# EasyEDA Pro project demo1.eprj

# Schematic Schematic1
Create Date: 2024-06-09; Page Name: P1; Project Name: demo1; Schematic Name: Schematic1; Update Date: 2024-07-16; Company: 嘉立创EDA; Page Size: A4; Version: V1.0
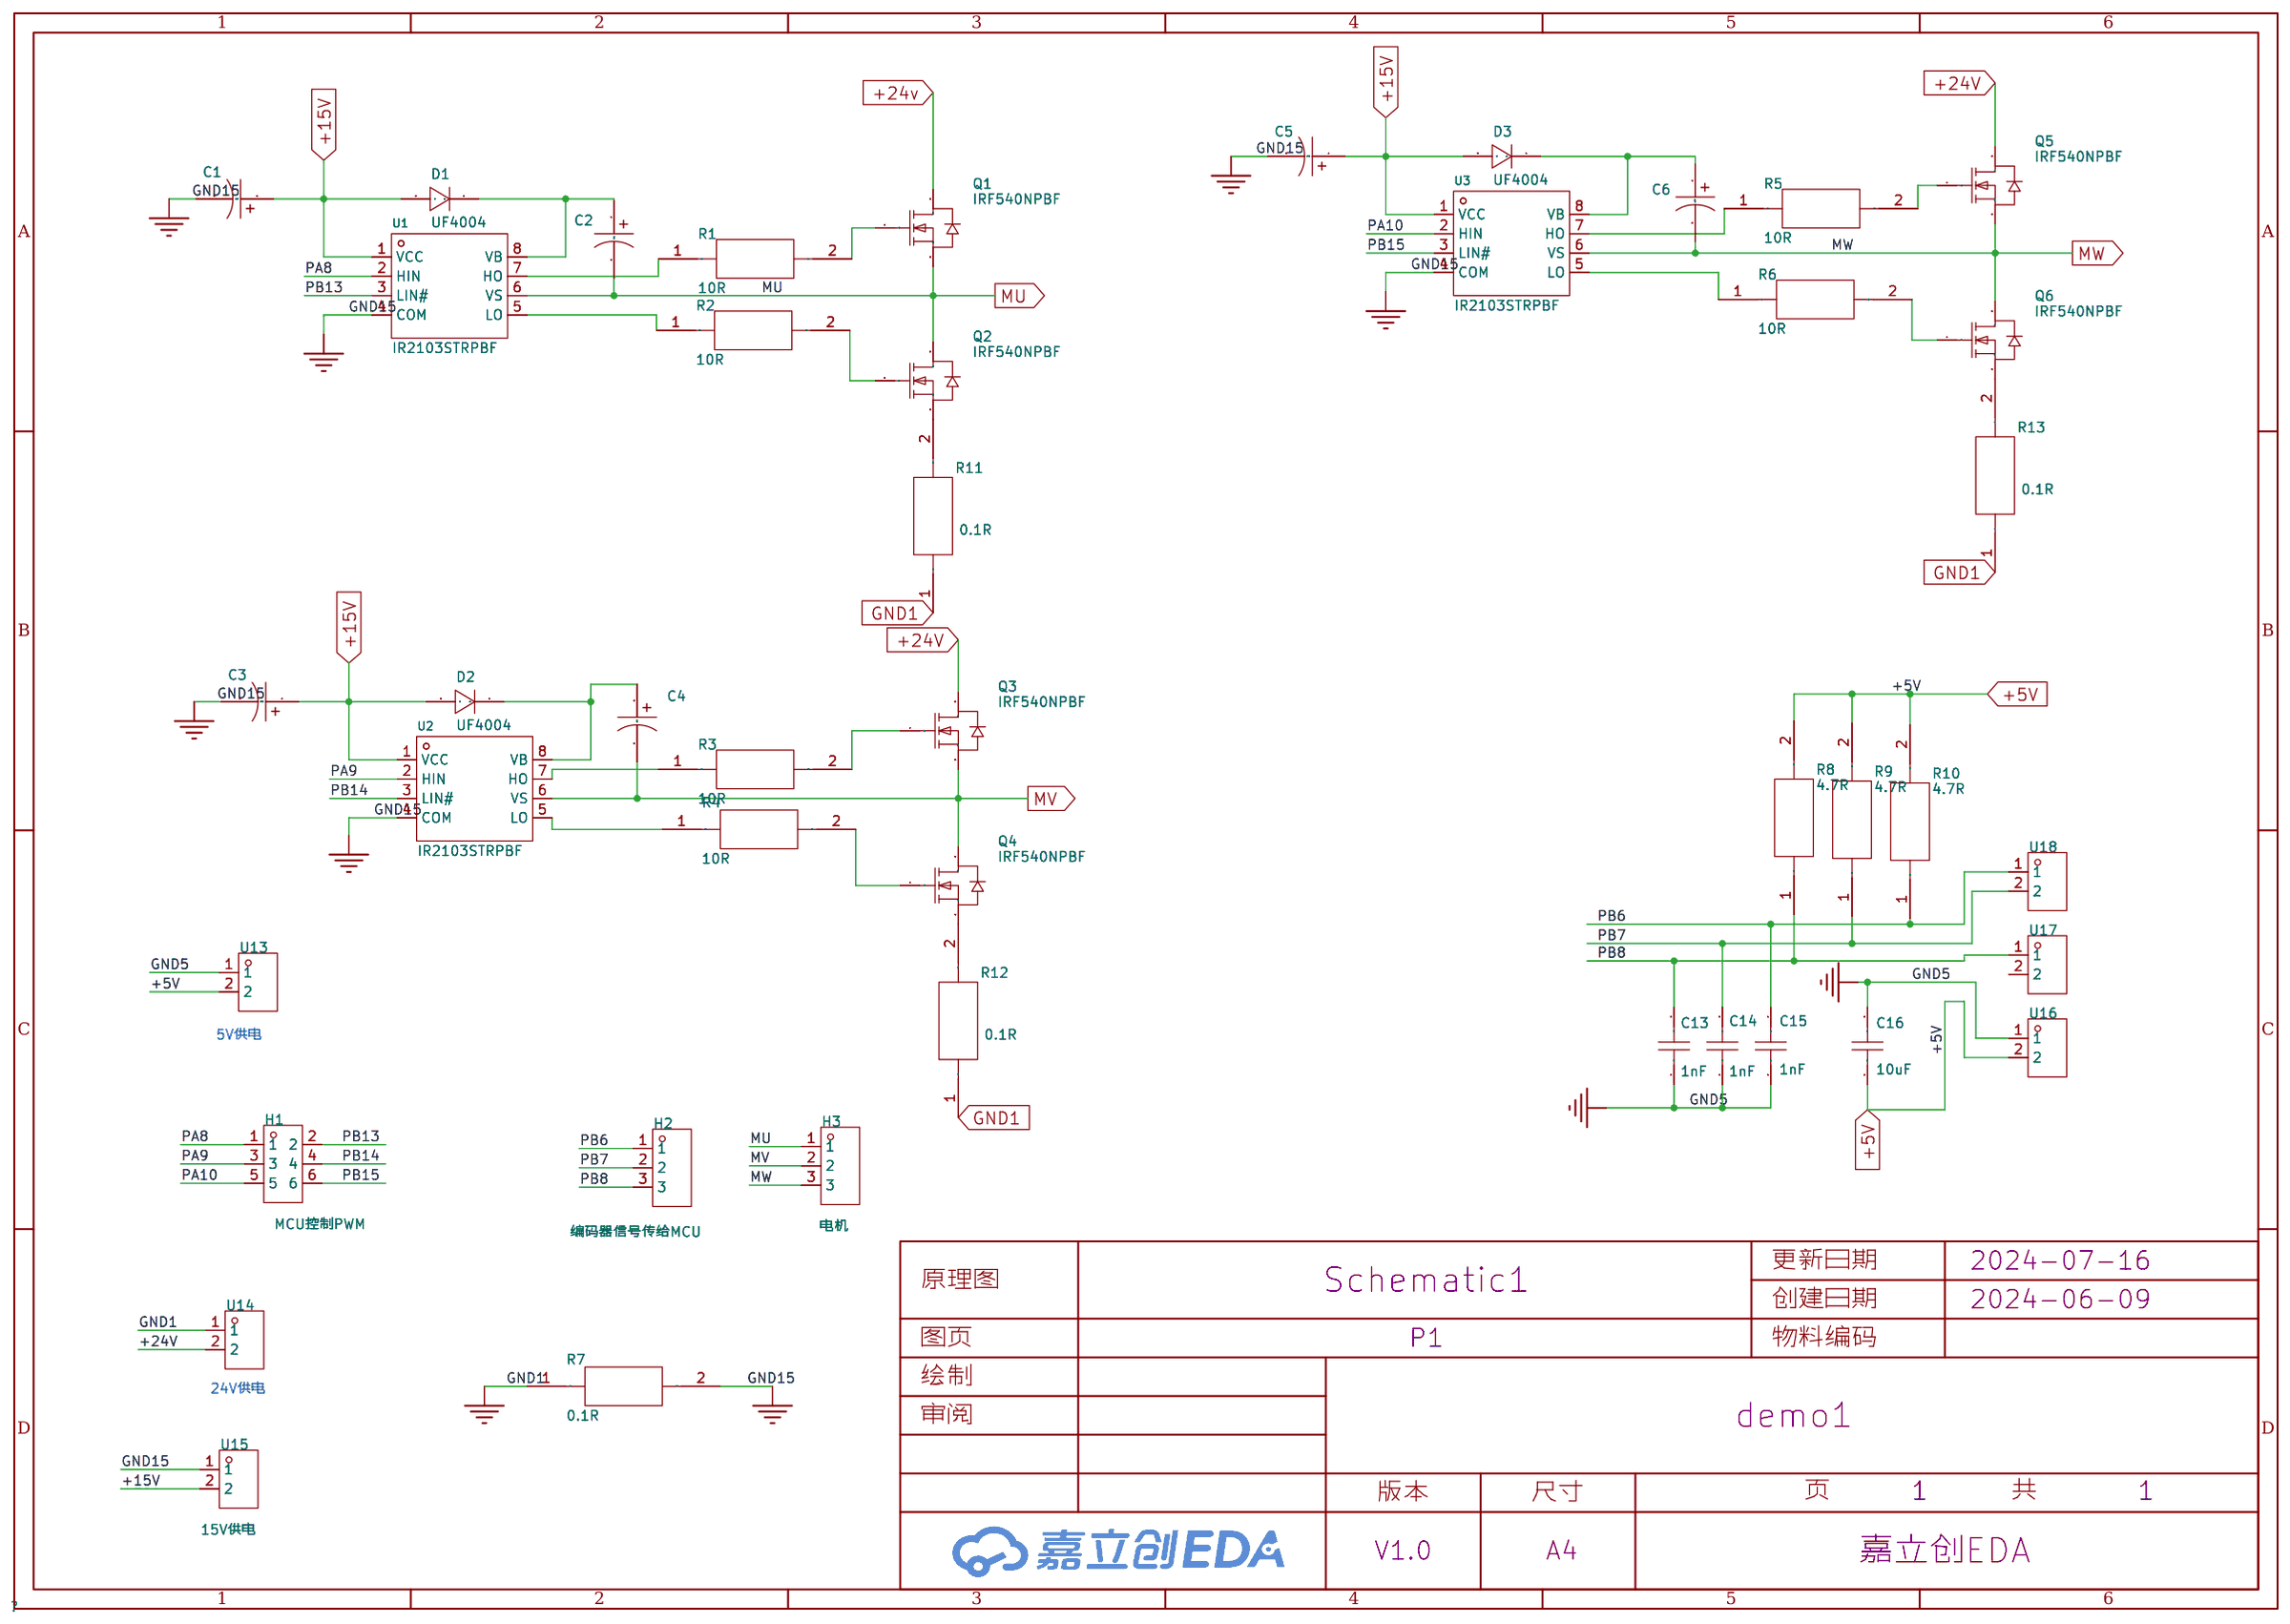
[diagram p0: schematic sheet]

## Parts
C1  -  [钽电容]
C2  -  [钽电容]
C3  -  [钽电容]
C4  -  [钽电容]
C5  -  [钽电容]
C6  -  [钽电容]
C13  1nF  [独石电容]
C14  1nF  [独石电容]
C15  1nF  [独石电容]
C16  10uF  [独石电容]
D1  UF4004  [DO-41_BD2.4-L4.7-P8.70-D0.9-RD]
D2  UF4004  [DO-41_BD2.4-L4.7-P8.70-D0.9-RD]
D3  UF4004  [DO-41_BD2.4-L4.7-P8.70-D0.9-RD]
H1  MCU控制PWM  [HDR-TH_6P-P2.54-V-M-R2-C3-S2.54]
H2  编码器信号传给MCU  [HDR-TH_3P-P2.54-V-M]
H3  电机  [HDR-TH_3P-P2.54-V-M]
Q1  IRF540NPBF  [TO-220-3_L10.0-W4.5-P2.54-L]
Q2  IRF540NPBF  [TO-220-3_L10.0-W4.5-P2.54-L]
Q3  IRF540NPBF  [TO-220-3_L10.0-W4.5-P2.54-L]
Q4  IRF540NPBF  [TO-220-3_L10.0-W4.5-P2.54-L]
Q5  IRF540NPBF  [TO-220-3_L10.0-W4.5-P2.54-L]
Q6  IRF540NPBF  [TO-220-3_L10.0-W4.5-P2.54-L]
R1  10R  [大电阻]
R2  10R  [大电阻]
R3  10R  [大电阻]
R4  10R  [大电阻]
R5  10R  [大电阻]
R6  10R  [大电阻]
R7  0.1R  [大电阻]
R8  4.7R  [大电阻]
R9  4.7R  [大电阻]
R10  4.7R  [大电阻]
R11  0.1R  [大电阻]
R12  0.1R  [大电阻]
R13  0.1R  [大电阻]
U1  IR2103STRPBF  [IR2103STRPBF]
U2  IR2103STRPBF  [IR2103STRPBF]
U3  IR2103STRPBF  [IR2103STRPBF]
U13  DB125-3.81-2P-GN-S  [CONN-TH_2P-P3.81_L7.4-W7.6]
U14  DB125-3.81-2P-GN-S  [CONN-TH_2P-P3.81_L7.4-W7.6]
U15  15V供电  [CONN-TH_2P-P3.81_L7.4-W7.6]
U16  DB125-3.81-2P-GN-S  [CONN-TH_2P-P3.81_L7.4-W7.6]
U17  DB125-3.81-2P-GN-S  [CONN-TH_2P-P3.81_L7.4-W7.6]
U18  DB125-3.81-2P-GN-S  [CONN-TH_2P-P3.81_L7.4-W7.6]

## Library data of the parts
C1-C6 = 钽电容
C13-C16 = 独石电容
D1-D3 = UF4004: 二极管配置:-;正向压降(Vf):1V@1A;直流反向耐压(Vr):400V;平均整流电流(Io):1A;; LCSC Part Name: 电压:400V 电流:1A; Supplier Part: C402308; Manufacturer: LGE(鲁光); Supplier Footprint: DO-41; JLCPCB Part Class: 扩展库; Datasheet: https://atta.szlcsc.com/upload/public/pdf/source/20190705/C402309_612B1FC0F422580FB6CB8C47AC7B40D2.pdf; Supplier: LCSC; Forward Voltage (Vf@If): 1V@1A; Reverse Voltage (Vr): 400V; Average Rectified Current (Io): 1A; Reverse Leakage Current: 10uA@400V
H1 = PZ254V-12-6P: 插针结构:2x3P;间距:2.54mm;行距:2.54mm;圆针/方针:方针;安装类型:直插;排数:双排;总PIN位数:6P;额定电流:-;额定电压:-;配合针长度:6mm;塑高:2.5mm;端接针长度:3mm;触头材质:黄铜;触头镀层:-;工作温度范围:-40℃~+105℃;颜色:黑色;; LCSC Part Name: 间距:2.54mm 2x3P 直插 方针; Supplier Part: C492420; Manufacturer: XFCN(兴飞); Supplier Footprint: 插件,P=2.54mm; JLCPCB Part Class: 扩展库; Datasheet: https://atta.szlcsc.com/upload/public/pdf/source/20200309/C492420_BAECB307B001054C09D200388220EAE6.pdf; Supplier: LCSC; Pin Structure: 2x3P; Pitch: 2.54mm; Row Spacing: 2.54mm; Circluar Pins/Square Pins: 方针; Mounting Type: 直插; Number of Rows: 双排; Number of Pins: 6P; Length of Mating Pin: 6mm; Insulation Height: 2.5mm; Length of End Connection Pin: 3mm; Contact Material: 黄铜; Operating Temperature Range: -40℃~+105℃; Color: 黑色
H2 H3 = PZ254V-11-03P: 插针结构:1x3P;间距:2.54mm;行距:-;圆针/方针:方针;安装类型:直插;排数:单排;总PIN位数:3P;额定电流:3A;额定电压:250V;配合针长度:6mm;塑高:2.5mm;端接针长度:3mm;工作温度范围:-40℃~+105℃;颜色:黑色;; LCSC Part Name: 间距:2.54mm 1x3P 直插 方针; Supplier Part: C2937625; Manufacturer: XFCN(兴飞); Supplier Footprint: 插件,P=2.54mm; JLCPCB Part Class: 扩展库; Datasheet: https://atta.szlcsc.com/upload/public/pdf/source/20200309/C492402_8335C3D49C4E4C618838D59BB1D024C1.pdf; Supplier: LCSC; Pin Structure: 1x3P; Pitch: 2.54mm; Circluar Pins/Square Pins: 方针; Mounting Type: 直插; Number of Rows: 单排; Number of Pins: 3P; Current Rating (Max): 3A; Voltage Rating (Max): 250V; Length of Mating Pin: 6mm; Insulation Height: 2.5mm; Length of End Connection Pin: 3mm; Operating Temperature Range: -40℃~+105℃; Color: 黑色
Q1-Q6 = IRF540NPBF: 类型:N沟道;漏源电压(Vdss):100V;连续漏极电流(Id):33A;功率(Pd):130W;导通电阻(RDS(on)@Vgs,Id):44mΩ@10V,16A;阈值电压(Vgs(th)@Id):4V@250uA;; LCSC Part Name: N沟道 耐压:100V 电流:33A; Supplier Part: C2566; Manufacturer: Infineon(英飞凌); Supplier Footprint: TO-220AB; JLCPCB Part Class: 扩展库; Datasheet: https://atta.szlcsc.com/upload/public/pdf/source/20140818/1457707225950.pdf; Supplier: LCSC; Type: N沟道; Drain Source Voltage (Vdss): 100V; Continuous Drain Current (Id): 33A; Power Dissipation (Pd): 130W; Drain Source On Resistance (RDS(on)@Vgs,Id): 44mΩ@10V,16A; Gate Threshold Voltage (Vgs(th)@Id): 4V@250uA; Total Gate Charge (Qg@Vgs): 71nC@10V; Input Capacitance (Ciss@Vds): 1.96nF@25V; Operating Temperature: -55℃~+175℃@(Tj)
R1-R13 = 电阻
U1-U3 = IR2103STRPBF: 驱动配置:半桥;负载类型:MOSFET；IGBT;驱动通道数:2;峰值灌电流:360mA;峰值拉电流:210mA;电源电压:10V~20V;上升时间:100ns;下降时间:50ns;; Supplier Part: C2957; Manufacturer: Infineon(英飞凌); Supplier Footprint: SOIC-8; JLCPCB Part Class: 扩展库; Datasheet: https://atta.szlcsc.com/upload/public/pdf/source/20140228/1457706997637.pdf; Supplier: LCSC; Driven Configuration: 半桥; Load Type: MOSFET；IGBT; Number of Drivers: 2; Peak Output Current(sink): 360mA; Peak Output Current(source): 210mA; Supply Voltage: 10V~20V; Rise Time: 100ns; Fall Time: 50ns; Operating Temperature: -40℃~+150℃@(Tj)
U13-U18 = DB125-3.81-2P-GN-S: 结构:1x2P;间距:3.81mm;颜色:绿色;安装方式:直插;额定电流:10A;额定电压:300V;排数:1;线规 - AWG:16~26;线规 - 平方毫米:0.5~1;每排PIN数:2;工作温度范围:-40℃~+105℃;; LCSC Part Name: 3.81mm 1x2P 排数:1 每排P数:2 直插; Supplier Part: C395878; Manufacturer: DORABO(地博电气); Supplier Footprint: 插件,P=3.81mm; JLCPCB Part Class: 扩展库; Datasheet: https://atta.szlcsc.com/upload/public/pdf/source/20220823/CB89165D0F406880B925A92BEEA3FB50.pdf; Supplier: LCSC; Structure: 1x2P; Pitch: 3.81mm; Color: 绿色; Mounting Style: 直插; Current Rating (Max): 10A; Voltage Rating (Max): 300V; Number of Pins: 2P; Number of Rows: 1; Wire Gauge - AWG: 16~26; Wire Gauge - mm2: 0.5~1; Number of PINs Per Row: 2; Operating Temperature Range: -40℃~+105℃

## Nets
+5V: C16.1 R8.2 R9.2 R10.2 U13.2 U16.2
+15V: C1.1 C3.1 C5.1 D1.2(A) D2.2(A) D3.2(A) U1.1(VCC) U2.1(VCC) U3.1(VCC) U15.2
+24V: Q3.2(D) Q5.2(D) U14.2
+24v: Q1.2(D)
GND1: R7.1 R11.1 R12.1 R13.1 U14.1
GND5: C13.1 C14.1 C15.1 C16.2 U13.1 U16.1
GND15: C1.2 C3.2 C5.2 R7.2 U1.4(COM) U2.4(COM) U3.4(COM) U15.1
MU: C2.2 H3.1 Q1.3(S) Q2.2(D) U1.6(VS)
MV: C4.2 H3.2 Q3.3(S) Q4.2(D) U2.6(VS)
MW: C6.2 H3.3 Q5.3(S) Q6.2(D) U3.6(VS)
PA8: H1.1 U1.2(HIN)
PA9: H1.3 U2.2(HIN)
PA10: H1.5 U3.2(HIN)
PB6: C15.2 H2.1 R10.1 U18.1
PB7: C14.2 H2.2 R9.1 U18.2
PB8: C13.2 H2.3 R8.1 U17.1
PB13: H1.2 U1.3(LIN#)
PB14: H1.4 U2.3(LIN#)
PB15: H1.6 U3.3(LIN#)
$1N1594: R6.1 U3.5(LO)
$1N1599: Q5.1(G) R5.2
$1N1600: Q6.1(G) R6.2
$1N1601: R5.1 U3.7(HO)
$1N1602: C6.1 D3.1(C) U3.8(VB)
$1N1612: Q3.1(G) R3.2
$1N1613: Q4.1(G) R4.2
$1N1615: R4.1 U2.5(LO)
$1N1616: C4.1 D2.1(C) U2.8(VB)
$1N1628: Q1.1(G) R1.2
$1N1629: Q2.1(G) R2.2
$1N1632: C2.1 D1.1(C) U1.8(VB)
$1N21308: R1.1 U1.7(HO)
$1N21337: R2.1 U1.5(LO)
$1N21506: R3.1 U2.7(HO)
$1N22655: Q2.3(S) R11.2
$1N22682: Q4.3(S) R12.2
$1N22709: Q6.3(S) R13.2

Not connected (* = marked no-connect by the designer): U17 2

## Notes on the sheet
- 5V供电
- 24V供电

# Board PCB1
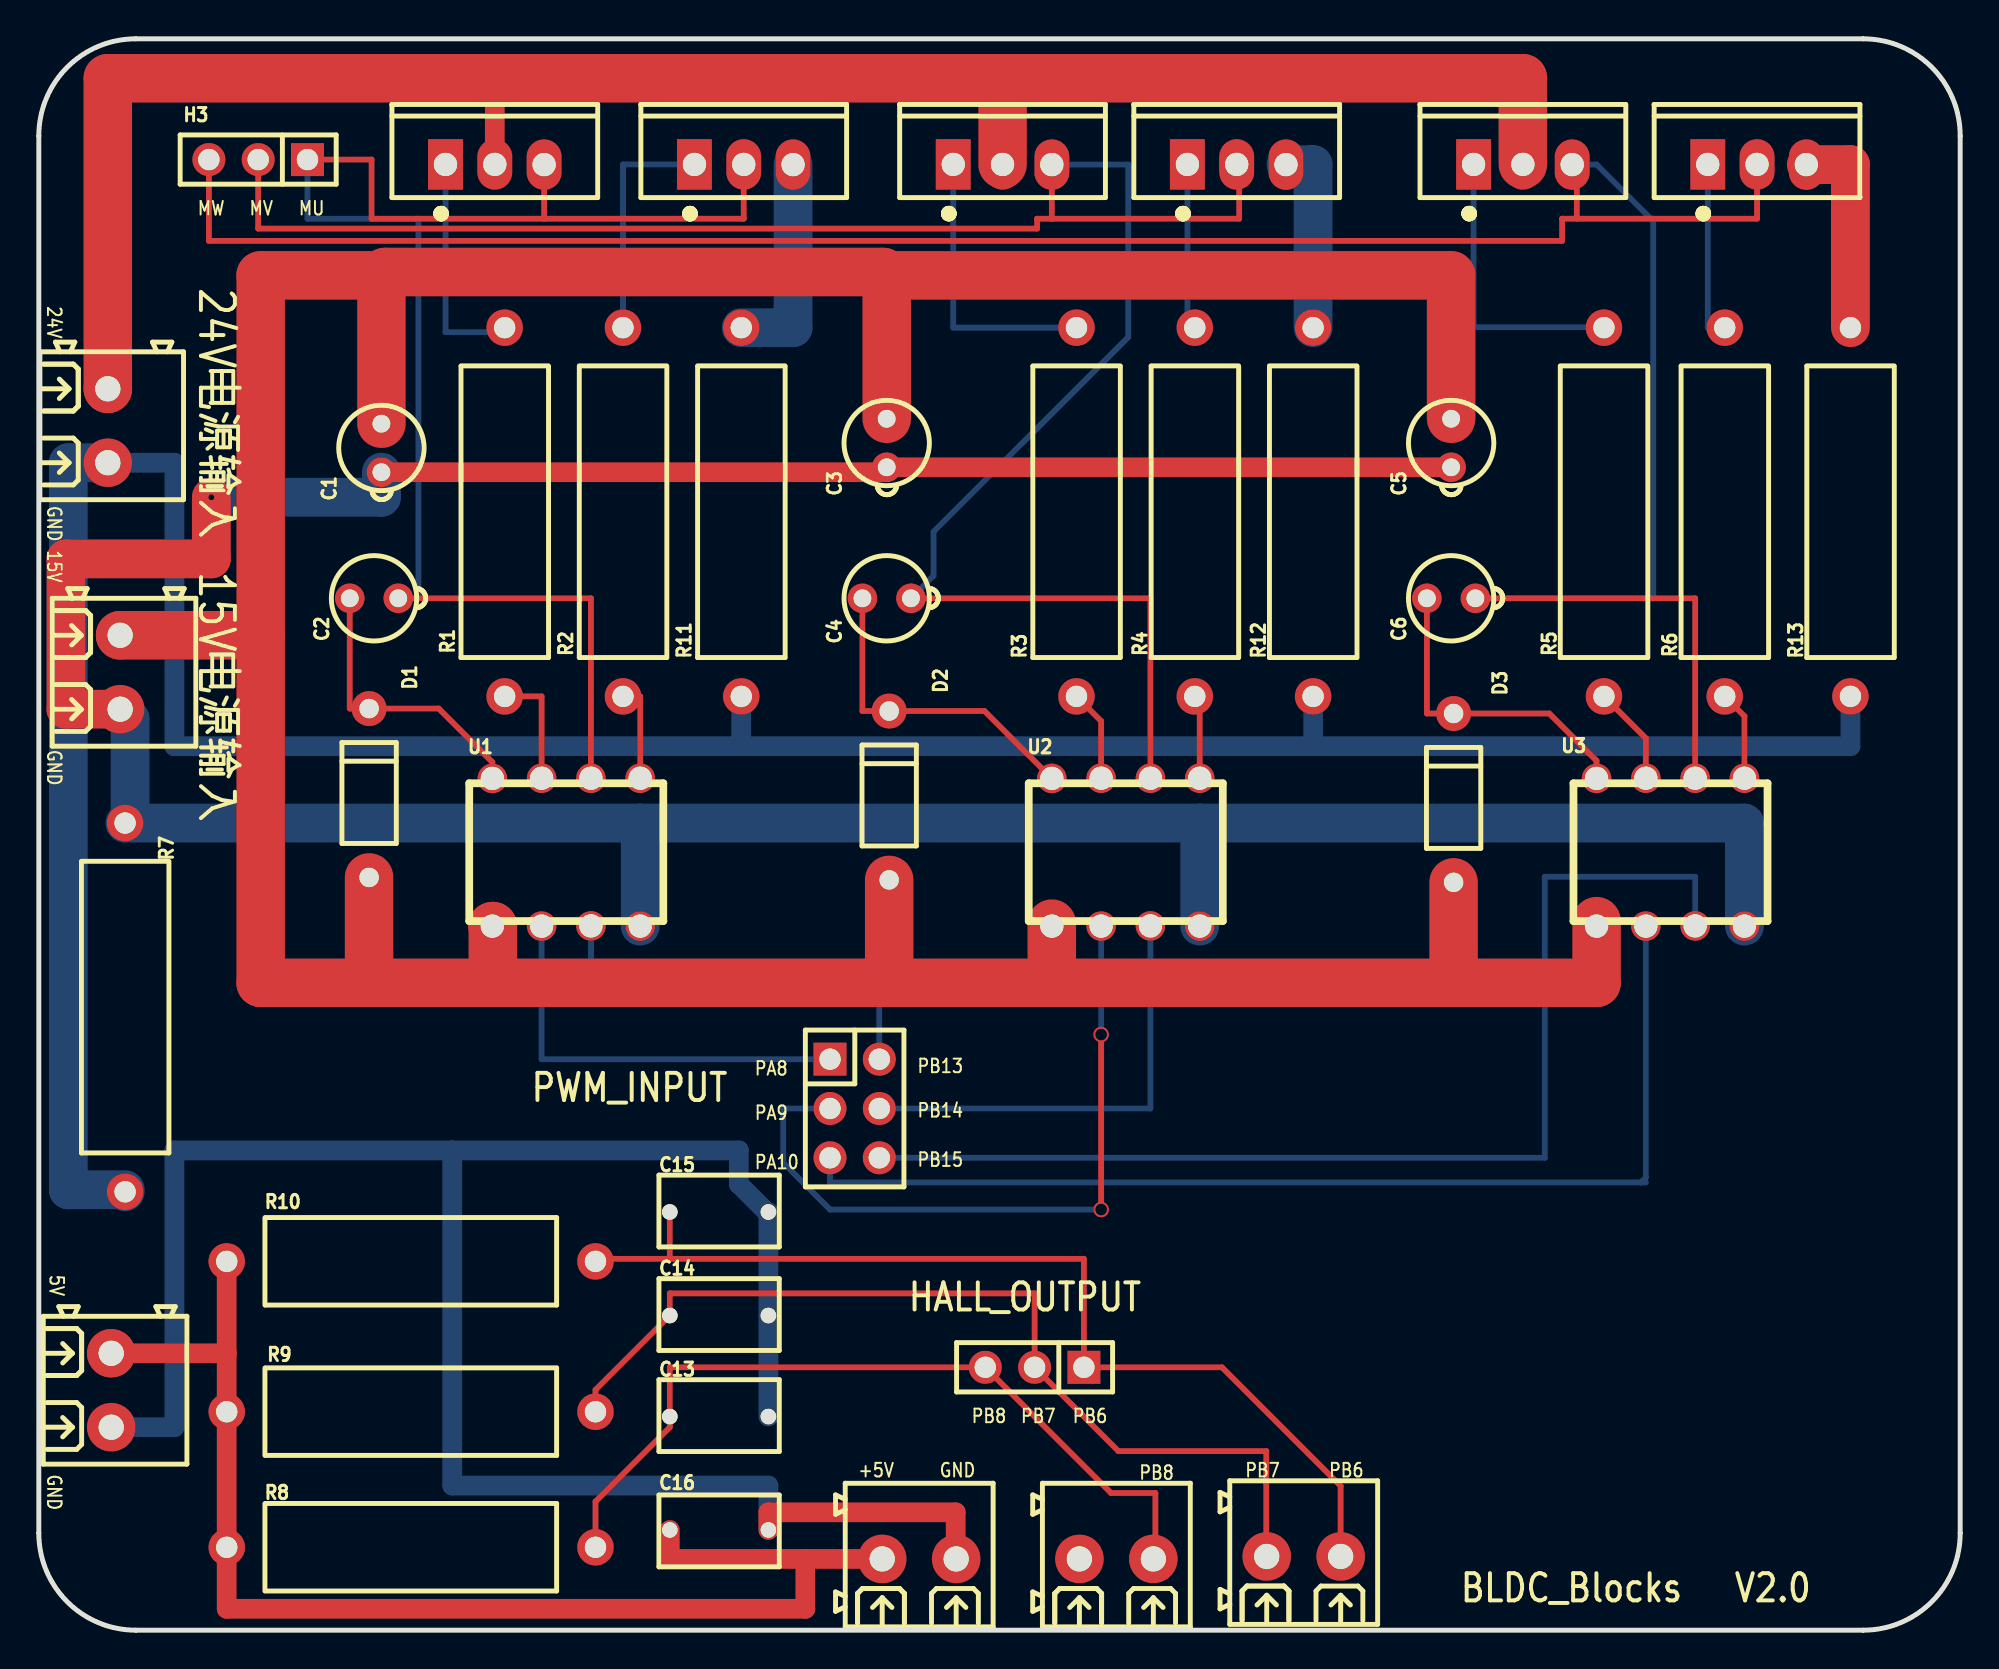
[diagram p1: board, top side]
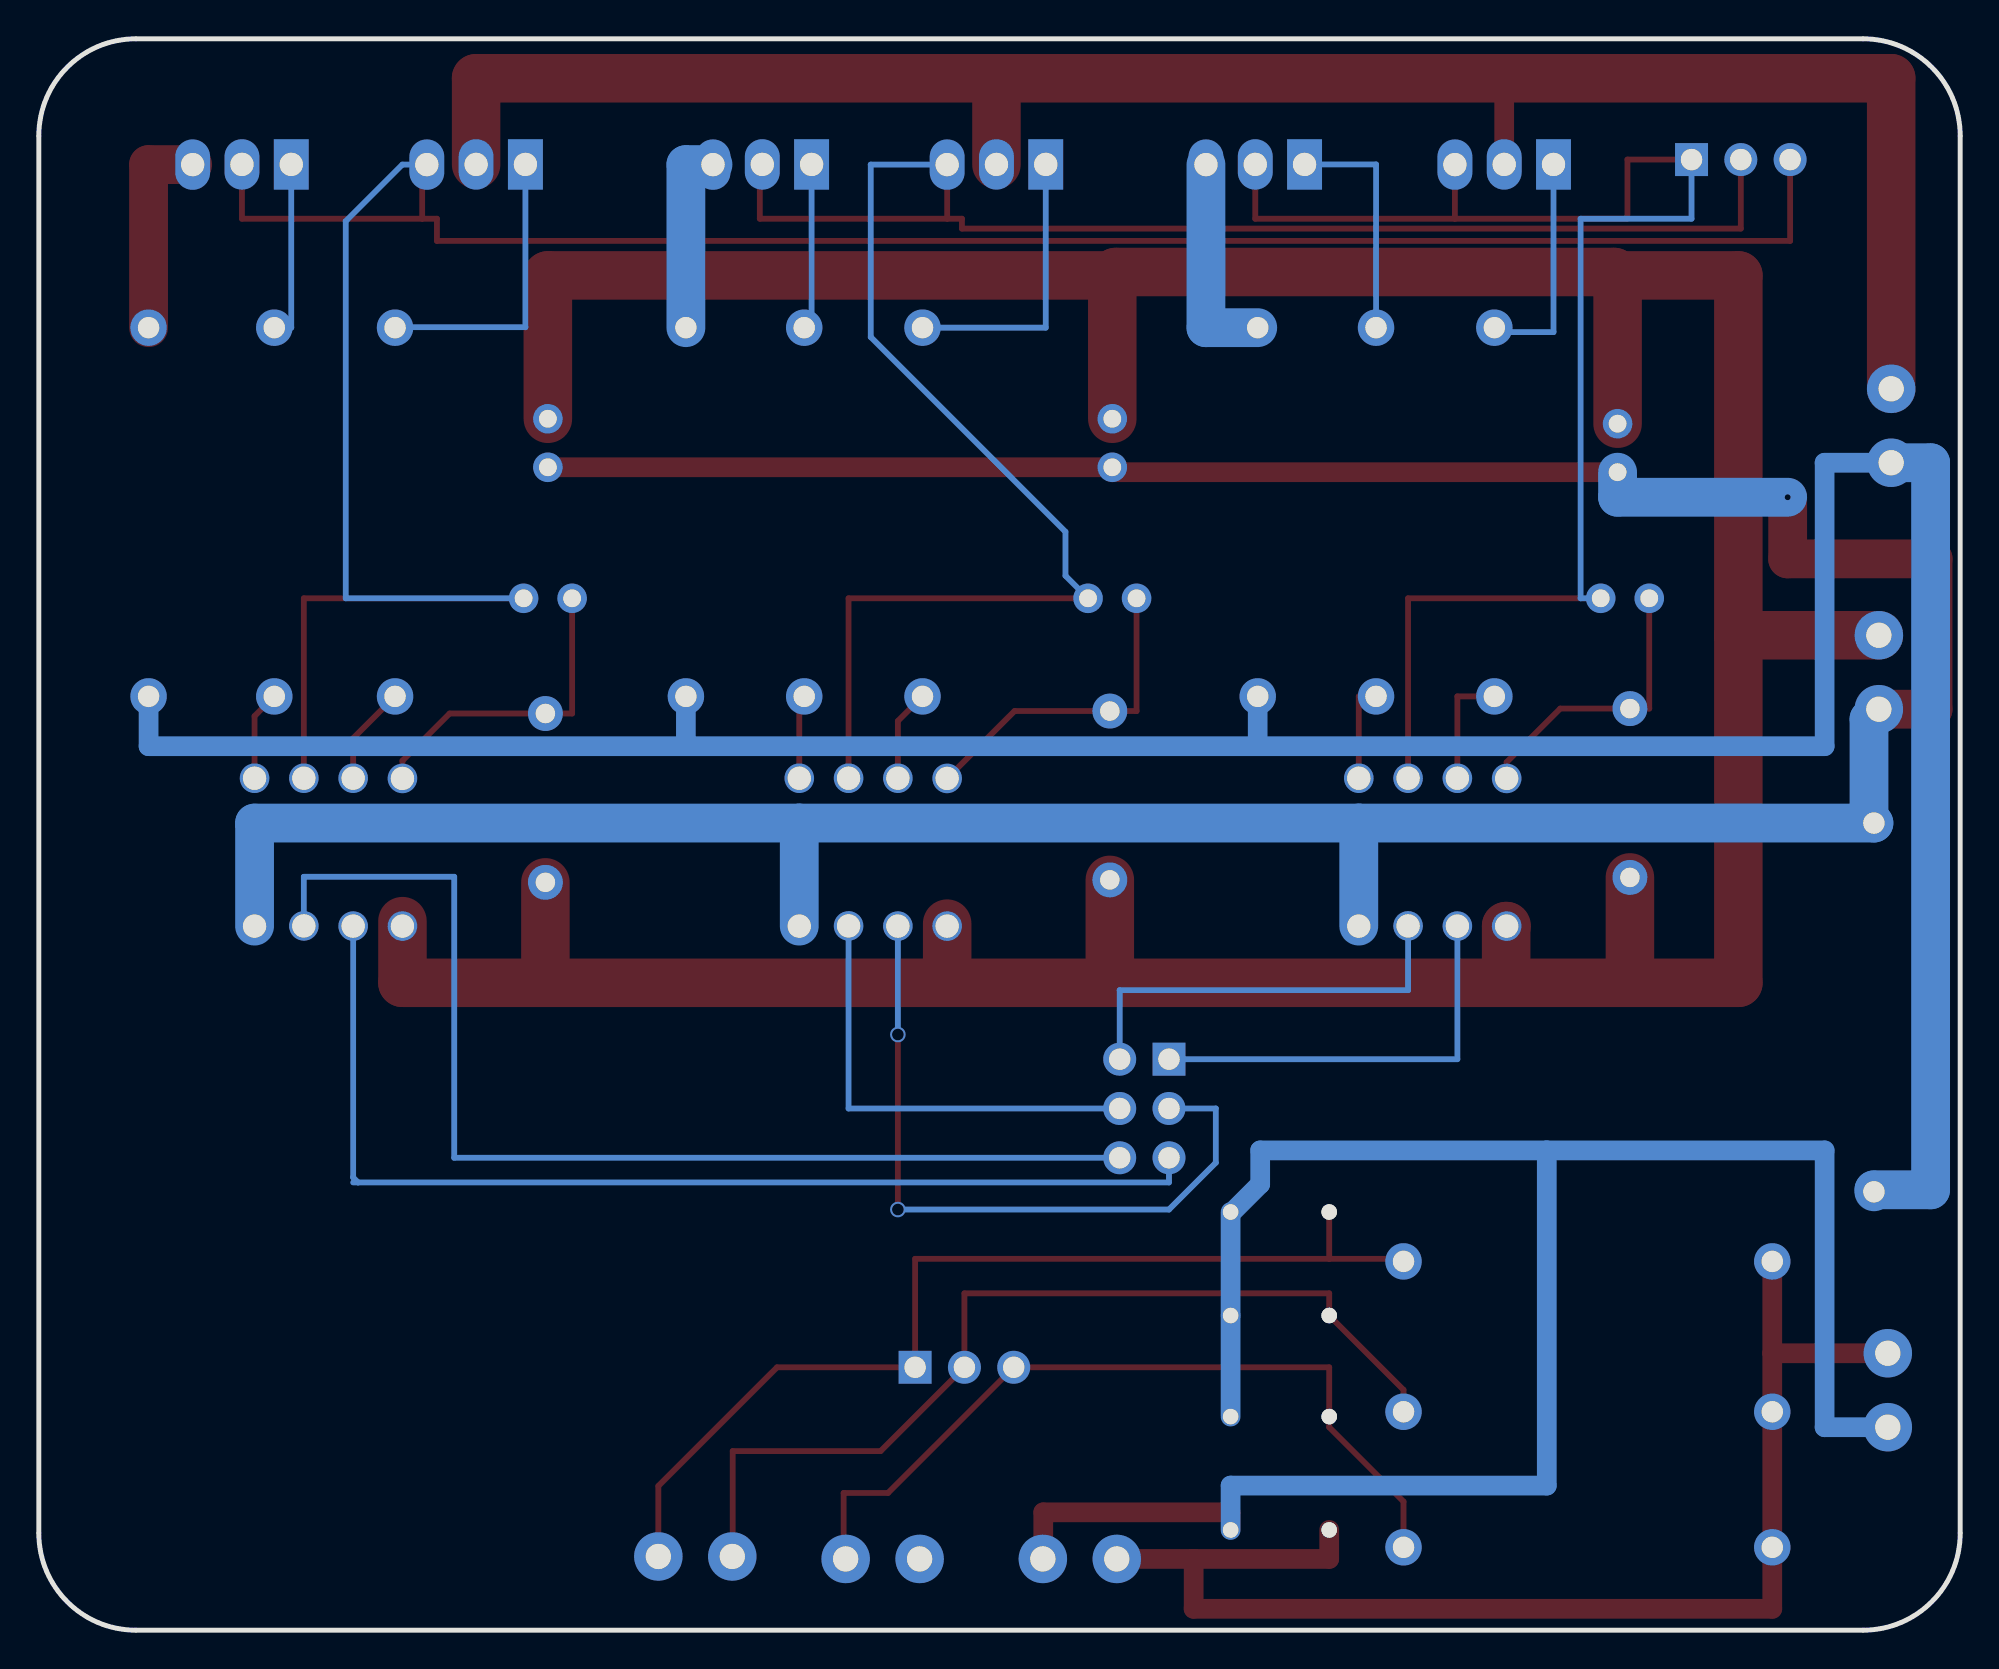
[diagram p2: board, bottom side, seen from below]

Outline 99 x 82 mm; copper layers: Top Layer, Bottom Layer. Coordinates in mm from the lower left corner of the outline.
Outline path: 0,77 0,5 arc(1.46,1.46) 5,0 94,0 arc(97.54,1.46) 99,5 99,77 arc(97.54,80.54) 94,82 5,82 arc(1.46,80.54) 0,77
Stack: Top Layer 0.035mm / Dielectric1 1.51mm FR4 er 4.5 / Bottom Layer 0.035mm

## Design rules (mm)
net +5V: pwr
net +24V: pwr
net +15V: pwr
net GND1: pwr
net GND5: pwr
net GND15: pwr
template: 自定义配置
spacing copperThickness1oz (default): track to track 0.203, other pairs 0.203 to 0.203
spacing copperThickness2oz: track to track 0.203, other pairs 0.152 to 0.3
track width copperThickness1oz (default): min 0.152, default 0.3, max 2
track width copperThickness2oz: min 0.203, default 0.254, max 2.54
track width pwr: min 0.762, default 1.016, max 5.08
differential pair differentialPair (default): width min 0.127, default 0.254, max 2.54; gap min 0.152, default 0.152
via viaSize (default): diameter min 0.61, default 0.61, max 1; hole min 0.305, default 0.305, max 1
net class pwr uses pwr
net +5V uses pwr
net +24V uses pwr
net +15V uses pwr
net GND1 uses pwr
net GND5 uses pwr
net GND15 uses pwr

## Placement (name value [footprint] x y rotation side)
C1  -  [钽电容]  17.65 60.92 270 top
C2  -  [钽电容]  17.27 53.17 0 top
C3  -  [钽电容]  43.69 61.17 270 top
C4  -  [钽电容]  43.69 53.17 0 top
C5  -  [钽电容]  72.77 61.17 270 top
C6  -  [钽电容]  72.77 53.17 0 top
C13  1nF  [独石电容]  35.05 11.01 180 top
C14  1nF  [独石电容]  35.05 16.21 180 top
C15  1nF  [独石电容]  35.05 21.55 180 top
C16  10uF  [独石电容]  35.05 5.16 0 top
D1  UF4004  [DO-41_BD2.4-L4.7-P8.70-D0.9-RD]  17.02 43.14 270 top
D2  UF4004  [DO-41_BD2.4-L4.7-P8.70-D0.9-RD]  43.81 43.01 270 top
D3  UF4004  [DO-41_BD2.4-L4.7-P8.70-D0.9-RD]  72.9 42.88 270 top
H1  MCU控制PWM  [HDR-TH_6P-P2.54-V-M-R2-C3-S2.54]  42.04 26.88 270 top
H2  编码器信号传给MCU  [HDR-TH_3P-P2.54-V-M]  51.31 13.55 180 top
H3  电机  [HDR-TH_3P-P2.54-V-M]  11.3 75.78 180 top
Q1  IRF540NPBF  [TO-220-3_L10.0-W4.5-P2.54-L]  23.5 75.52 0 top
Q2  IRF540NPBF  [TO-220-3_L10.0-W4.5-P2.54-L]  36.32 75.52 0 top
Q3  IRF540NPBF  [TO-220-3_L10.0-W4.5-P2.54-L]  49.66 75.52 0 top
Q4  IRF540NPBF  [TO-220-3_L10.0-W4.5-P2.54-L]  61.72 75.52 0 top
Q5  IRF540NPBF  [TO-220-3_L10.0-W4.5-P2.54-L]  76.47 75.52 0 top
Q6  IRF540NPBF  [TO-220-3_L10.0-W4.5-P2.54-L]  88.53 75.52 0 top
R1  10R  [大电阻]  24 57.62 90 top
R2  10R  [大电阻]  30.1 57.62 90 top
R3  10R  [大电阻]  53.47 57.62 90 top
R4  10R  [大电阻]  59.56 57.62 90 top
R5  10R  [大电阻]  80.65 57.62 90 top
R6  10R  [大电阻]  86.87 57.62 90 top
R7  0.1R  [大电阻]  4.44 32.09 90 top
R8  4.7R  [大电阻]  19.18 4.27 180 top
R9  4.7R  [大电阻]  19.18 11.26 180 top
R10  4.7R  [大电阻]  19.18 19 180 top
R11  0.1R  [大电阻]  36.19 57.62 90 top
R12  0.1R  [大电阻]  65.66 57.62 90 top
R13  0.1R  [大电阻]  93.34 57.62 90 top
U1  -  [IR2103STRPBF]  27.18 40.09 0 top
U2  -  [IR2103STRPBF]  56.01 40.09 0 top
U3  -  [IR2103STRPBF]  84.07 40.09 0 top
U13  DB125-3.81-2P-GN-S  [CONN-TH_2P-P3.81_L7.4-W7.6]  3.73 12.36 90 top
U14  DB125-3.81-2P-GN-S  [CONN-TH_2P-P3.81_L7.4-W7.6]  3.56 62.06 90 top
U15  15V供电  [CONN-TH_2P-P3.81_L7.4-W7.6]  4.19 49.36 90 top
U16  DB125-3.81-2P-GN-S  [CONN-TH_2P-P3.81_L7.4-W7.6]  45.36 3.67 180 top
U17  DB125-3.81-2P-GN-S  [CONN-TH_2P-P3.81_L7.4-W7.6]  55.52 3.67 180 top
U18  DB125-3.81-2P-GN-S  [CONN-TH_2P-P3.81_L7.4-W7.6]  65.17 3.8 180 top

## Footprints (pads in the part's own frame, mm; a bottom-side part is the same pattern mirrored in y, then rotated)
CONN-TH_2P-P3.81_L7.4-W7.6
  round 2.5 hole 1.3: 1(-1.905,0) 2(1.905,0)
DO-41_BD2.4-L4.7-P8.70-D0.9-RD
  round 1.8 hole 1: 1(-4.35,0) 2(4.35,0)
HDR-TH_3P-P2.54-V-M
  rect 1.7x1.7 hole 1.1: 1(-2.54,0)
  round 1.7 hole 1.1: 2(0,0) 3(2.54,0)
HDR-TH_6P-P2.54-V-M-R2-C3-S2.54
  rect 1.7x1.7 hole 1.1: 1(-2.54,-1.27)
  round 1.7 hole 1.1: 2(-2.54,1.27) 3(0,-1.27) 4(0,1.27) 5(2.54,-1.27) 6(2.54,1.27)
IR2103STRPBF
  round 1.524 hole 1.2: 1(-3.81,-3.81) 2(-1.27,-3.81) 3(1.27,-3.8) 4(3.81,-3.81) 5(3.81,3.81) 6(1.27,3.81) 7(-1.27,3.81) 8(-3.81,3.8)
TO-220-3_L10.0-W4.5-P2.54-L
  rect 1.8x2.6 hole 1.2: 1(-2.54,0.005)
  oval 1.8x2.6 hole 1.2: 2(0,0.005) 3(2.54,-0.005)
大电阻
  round 1.879 hole 1.1: 1(-9.5,0) 2(9.5,0)
独石电容
  round 0.8 hole 0.914x0.55: 1(-2.54,0) 2(2.54,0)
钽电容
  round 1.524 hole 0.914: 1(-1.25,0) 2(1.25,0)

## Nets
As in the schematic, except:
+24V: Q1.2 Q3.2 Q5.2 U14.2

Pads without a net: U17 2

## Via types
v1: diameter 0.8, hole 0.6, Top Layer to Bottom Layer, 2 vias
v2: diameter 0.61, hole 0.305, Top Layer to Bottom Layer, 1 via

## Routing (per net, layer and track width the routed paths; a pad name or vN(x,y) marks a point on that pad's centre or on a via; arc(x,y) is an arc through that point)
+5V: length 68.7
  Top Layer w1.016: C16.1 32.51,3.67 39.5,3.67 ; 39.5,3.67 39.5,1.1 9.68,1.1 R8.2 R9.2 9.68,14.27 ; 39.5,3.67 U16.2 ; 9.68,14.27 R10.2 ; 9.68,14.27 U13.2
+15V: length 221.5
  Top Layer w2.5: 52.2,33.36 72.9,33.36 ; 52.2,33.36 43.81,33.36 ; 52.2,33.36 52.2,36.41 ; 72.9,33.36 80.26,33.36 80.26,36.53 ; 72.9,33.36 D3.2 ; 17.02,33.36 11.43,33.36 11.43,51.27 ; 17.02,33.36 23.39,33.36 ; 17.02,33.36 D1.2 ; 43.69,69.81 43.51,69.98 17.83,69.98 17.65,69.81 ; 43.69,69.81 C3.1 ; 43.69,69.81 72.77,69.81 C5.1 ; 23.39,33.36 23.39,36.28 U1.1 ; 23.39,33.36 43.81,33.36 ; 11.43,51.27 11.43,69.81 17.65,69.81 ; 11.43,51.27 U15.2 ; C1.1 17.65,69.81 ; 43.81,33.36 D2.2
+24V: length 102.2
  Top Layer w1.016: Q1.2 23.5,79.97
  Top Layer w2.5: 49.66,79.97 76.47,79.97 Q5.2 ; 49.66,79.97 Q3.2 ; 49.66,79.97 3.56,79.97 U14.2
GND1: length 154.6
  Bottom Layer w1.016: 65.66,45.55 93.34,45.55 R13.1 ; 65.66,45.55 36.19,45.55 ; 65.66,45.55 R12.1 ; 36.19,45.55 R11.1 ; 36.19,45.55 6.98,45.55 6.98,60.16 U14.1
  Bottom Layer w2: R7.1 4.44,22.69 1.52,22.69 1.52,60.16 U14.1
GND5: length 109.7
  Top Layer w1.016: U16.1 47.24,3.67 47.24,6.07 37.59,6.07 C16.2
  Bottom Layer w1.016: 21.3,24.72 21.3,7.45 37.59,7.45 C16.2 ; 21.3,24.72 6.98,24.72 6.98,10.46 U13.1 ; 21.3,24.72 36.07,24.72 36.07,22.98 37.5,21.55 ; C15.1 C14.1 C13.1
GND15: length 192.2
  Top Layer w1.016: C5.2 C3.2 43.69,59.67 C1.2
  Top Layer w2: v2(8.89,58.38) 8.89,55.2 1.4,55.2 1.4,47.46 U15.1
  Bottom Layer w2: U2.4 59.82,41.59 ; 59.82,41.59 87.88,41.59 U3.4 ; 59.82,41.59 30.99,41.59 ; C1.2 17.65,58.38 v2(8.89,58.38) ; U1.4 30.99,41.59 ; 30.99,41.59 R7.2 4.7,41.84 4.7,46.95 U15.1
MU: length 79.7
  Top Layer w0.3: H3.1 17.14,75.78 17.14,72.73 26.03,72.73 ; 26.03,72.73 36.32,72.73 Q2.2 ; 26.03,72.73 Q1.3 ; C2.2 28.45,53.17 U1.6
  Bottom Layer w0.3: H3.1 13.84,72.73 19.56,72.73 19.56,53.17 C2.2
MV: length 112.9
  Top Layer w0.3: Q3.3 52.2,72.73 ; 52.2,72.73 61.85,72.73 61.85,75.53 Q4.2 ; 52.2,72.73 51.44,72.73 51.44,72.22 11.3,72.22 H3.2 ; 57.28,43.9 57.28,53.17 C4.2
  Bottom Layer w0.3: Q3.3 56.13,75.52 56.13,66.63 46.1,56.6 46.1,54.33 C4.2
MW: length 145.5
  Top Layer w0.3: C6.2 85.34,53.17 U3.6 ; Q5.3 79.25,75.52 79.25,72.73 ; 79.25,72.73 78.49,72.73 78.49,71.59 8.76,71.59 8.76,75.78 ; 79.25,72.73 88.53,72.73 Q6.2
  Bottom Layer w0.3: C6.2 83.19,53.17 83.19,72.6 80.27,75.52 Q5.3
PA8: length 21.7
  Bottom Layer w0.3: U1.2 25.91,29.42 H1.1
PA9: length 37.2
  Top Layer w0.3: v1(54.74,21.67) v1(54.74,30.69)
  Bottom Layer w0.3: v1(54.74,21.67) 40.77,21.67 38.35,24.09 38.35,26.88 H1.3 ; v1(54.74,30.69) U2.2
PA10: length 56.6
  Bottom Layer w0.3: H1.5 40.77,23.07 82.55,23.07 ; 82.55,23.07 82.8,23.33 U3.2 ; 82.55,23.07 82.8,23.07
PB6: length 52.7
  Top Layer w0.3: U18.1 67.08,7.43 60.96,13.55 H2.1 53.85,19.14 32.51,19.14 ; R10.1 28.68,19.14 32.51,19.14 ; 32.51,19.14 C15.2
PB7: length 49.5
  Top Layer w0.3: U18.2 63.25,3.8 63.25,9.23 55.63,9.23 H2.2 51.31,17.36 32.51,17.36 C14.2 28.68,12.38 R9.1
PB8: length 42.1
  Top Layer w0.3: R8.1 28.68,6.63 32.51,10.46 C13.2 32.51,13.55 H2.3 55.25,7.07 57.53,7.07 57.53,3.67 U17.1
PB13: length 21.7
  Bottom Layer w0.3: U1.3 28.45,32.98 43.31,32.98 H1.2
PB14: length 23.4
  Bottom Layer w0.3: 57.28,36.29 57.28,26.88 H1.4
PB15: length 59
  Bottom Layer w0.3: U3.3 85.34,38.82 77.6,38.82 77.6,24.34 H1.6
$1N1594: length 4.6
  Top Layer w0.3: R6.1 87.88,47.1 U3.5
$1N1599: length 15.1
  Bottom Layer w0.3: R5.2 80.65,67.14 73.93,67.14 Q5.1
$1N1600: length 9.3
  Bottom Layer w0.3: Q6.1 85.99,67.12 R6.2
$1N1601: length 5.1
  Top Layer w0.3: U3.7 82.8,45.96 R5.1
$1N1602: length 16.6
  Top Layer w0.3: C6.1 71.52,47.23 D3.1 77.83,47.23 80.26,44.8 U3.8
$1N1612: length 14.8
  Bottom Layer w0.3: 47.12,75.53 47.12,67.12 R3.2
$1N1613: length 8.8
  Bottom Layer w0.3: Q4.1 59.18,67.12 R4.2
$1N1615: length 4.5
  Top Layer w0.3: U2.5 59.82,48.12 R4.1
$1N1616: length 17
  Top Layer w0.3: C4.1 42.44,47.36 D2.1 48.73,47.36 U2.8
$1N1628: length 11.9
  Bottom Layer w0.3: R1.2 24,66.89 20.95,66.89 Q1.1
$1N1629: length 12.1
  Bottom Layer w0.3: R2.2 30.1,75.53 Q2.1
$1N1632: length 15
  Top Layer w0.3: U1.8 23.37,44.73 20.61,47.49 D1.1 16.02,47.49 C2.1
$1N21308: length 6.1
  Top Layer w0.3: U1.7 25.91,48.12 R1.1
$1N21337: length 5.1
  Top Layer w0.3: U1.5 30.99,48.12 R2.1
$1N21506: length 4.7
  Top Layer w0.3: R3.1 54.74,46.85 U2.7
$1N22655: length 11.1
  Bottom Layer w2: Q2.3 38.86,67.12 R11.2
$1N22682: length 9.8
  Bottom Layer w2: R12.2 65.66,75.52 Q4.3
$1N22709: length 10.7
  Top Layer w2: 91.07,75.52 93.34,75.52 R13.2

## Text on the board
Top Silkscreen Layer: PB8 | PB7 | PB6 | 24V | GND | 15V | MW | MV | MU | PA8 | PA9 | PA10 | PB13 | PB14 | PB15 | 5V | +5V | HALL_OUTPUT | PWM_INPUT | BLDC_Blocks   V2.0 | 24V电源输入 | 15V电源输入 | BLDC_Blocks      V1.0
